# EasyEDA schematic Streamdeckv1_schematic.json
TITLE: Streamdeck PCB; REV: 1.0; Date: 2021-02-21; Sheet: 1/1; Drawn By: Sean Kelly; Company: Kelly Cafe

## Parts
B1  SPARKFUN_PRO_MICRO  [SPARKFUN_PRO_MICRO]
D1  DIODEDO-1N4148  [DO-1N4148]
D2  DIODEDO-1N4148  [DO-1N4148]
D3  DIODEDO-1N4148  [DO-1N4148]
D4  DIODEDO-1N4148  [DO-1N4148]
D5  DIODEDO-1N4148  [DO-1N4148]
D6  DIODEDO-1N4148  [DO-1N4148]
D7  DIODEDO-1N4148  [DO-1N4148]
D8  DIODEDO-1N4148  [DO-1N4148]
D9  DIODEDO-1N4148  [DO-1N4148]
D10  DIODEDO-1N4148  [DO-1N4148]
D11  DIODEDO-1N4148  [DO-1N4148]
D12  DIODEDO-1N4148  [DO-1N4148]
D13  DIODEDO-1N4148  [DO-1N4148]
D14  DIODEDO-1N4148  [DO-1N4148]
D15  DIODEDO-1N4148  [DO-1N4148]
D16  DIODEDO-1N4148  [DO-1N4148]
D17  LED3MM  [LED_3MM]
D18  LED3MM  [LED_3MM]
D19  LED3MM  [LED_3MM]
D20  DIODEDO-1N4148  [DO-1N4148]
R1  330  [AXIAL-0.3]
R2  330  [AXIAL-0.3]
R3  330  [AXIAL-0.3]
RE_0_1  CHERRY-MX-ENCODER  [CHERRY-MX-ENCODER]  (sections 1,2)
RE_0_4  CHERRY-MX-ENCODER  [CHERRY-MX-ENCODER]  (sections 1,2)
RE_3_0  CHERRY-MX-ENCODER  [CHERRY-MX-ENCODER]  (sections 1,2)
RE_3_1  CHERRY-MX-ENCODER  [CHERRY-MX-ENCODER]  (sections 1,2)
RE_3_4  CHERRY-MX-ENCODER  [CHERRY-MX-ENCODER]  (sections 1,2)
S2  MOMENTARY-SWITCH-SPST-LED-PTH-CHERRY  [CHERRY-MX-LED]
S3  MOMENTARY-SWITCH-SPST-LED-PTH-CHERRY  [CHERRY-MX-LED]
S5  MOMENTARY-SWITCH-SPST-LED-PTH-CHERRY  [CHERRY-MX-LED]
S6  MOMENTARY-SWITCH-SPST-LED-PTH-CHERRY  [CHERRY-MX-LED]
S7  MOMENTARY-SWITCH-SPST-LED-PTH-CHERRY  [CHERRY-MX-LED]
S8  MOMENTARY-SWITCH-SPST-LED-PTH-CHERRY  [CHERRY-MX-LED]
S9  MOMENTARY-SWITCH-SPST-LED-PTH-CHERRY  [CHERRY-MX-LED]
S10  MOMENTARY-SWITCH-SPST-LED-PTH-CHERRY  [CHERRY-MX-LED]
S11  MOMENTARY-SWITCH-SPST-LED-PTH-CHERRY  [CHERRY-MX-LED]
S12  MOMENTARY-SWITCH-SPST-LED-PTH-CHERRY  [CHERRY-MX-LED]
S14  MOMENTARY-SWITCH-SPST-LED-PTH-CHERRY  [CHERRY-MX-LED]
S15  MOMENTARY-SWITCH-SPST-LED-PTH-CHERRY  [CHERRY-MX-LED]
S17  MOMENTARY-SWITCH-SPST-PTH-6.0MM  [TACTILE_SWITCH_PTH_6.0MM]

## Nets
GND: B1.3(GND) B1.4(GND) B1.23(GND) D17.K(C) D18.K(C) D19.K(C) RE_0_1.C RE_0_4.C RE_3_0.C RE_3_1.C RE_3_4.C S17.1
VCC: B1.21(VCC)
COL0: B1.8(*5) RE_3_0.E(2) RE_3_0.S2(2)
COL1: B1.9(*6) RE_0_1.E(2) RE_0_1.S2(2) RE_3_1.E(2) RE_3_1.S2(2) S5.S2(2) S9.S2(2)
COL2: B1.10(7) S2.S2(2) S6.S2(2) S10.S2(2) S14.S2(2)
COL3: B1.11(8) S3.S2(2) S7.S2(2) S11.S2(2) S15.S2(2)
COL4: B1.12(*9) RE_0_4.E(2) RE_0_4.S2(2) RE_3_4.E(2) RE_3_4.S2(2) S8.S2(2) S12.S2(2)
ENCODER0_L0: B1.14(11(MOSI)) RE_0_1.B RE_3_0.B RE_3_1.B
ENCODER0_L1: B1.7(4) RE_0_1.A RE_3_0.A RE_3_1.A
ENCODER1_L0: B1.6(*3) RE_0_4.B RE_3_4.B
ENCODER1_L1: B1.5(2) RE_0_4.A RE_3_4.A
LED0: B1.13(*10) R3.P$2(2)
LED1: B1.16(13(SCK)) R2.P$2(2)
LED2: B1.15(12(MISO)) R1.P$2(2)
NC/RX/D2: B1.2(RXI)
NC/TX/D3: B1.1(TXO)
RAW: B1.24(RAW)
RESET: B1.22(RESET) S17.3(2)
ROW0: B1.20(A3) D1.C D2.C D3.C D4.C
ROW1: B1.19(A2) D5.C D6.C D7.C D8.C
ROW2: B1.18(A1) D9.C D10.C D11.C D12.C
ROW3: B1.17(A0) D13.C D14.C D15.C D16.C D20.C
Net-(D1-A): D1.A RE_0_1.D(1) RE_0_1.S1(1)
Net-(D2-A): D2.A S2.S1(1)
Net-(D3-A): D3.A S3.S1(1)
Net-(D4-A): D4.A RE_0_4.D(1) RE_0_4.S1(1)
Net-(D5-A): D5.A S5.S1(1)
Net-(D6-A): D6.A S6.S1(1)
Net-(D7-A): D7.A S7.S1(1)
Net-(D8-A): D8.A S8.S1(1)
Net-(D9-A): D9.A S9.S1(1)
Net-(D10-A): D10.A S10.S1(1)
Net-(D11-A): D11.A S11.S1(1)
Net-(D12-A): D12.A S12.S1(1)
Net-(D13-A): D13.A RE_3_1.D(1) RE_3_1.S1(1)
Net-(D14-A): D14.A S14.S1(1)
Net-(D15-A): D15.A S15.S1(1)
Net-(D16-A): D16.A RE_3_4.D(1) RE_3_4.S1(1)
Net-(D17-A): D17.A R1.P$1(1)
Net-(D18-A): D18.A R2.P$1(1)
Net-(D19-A): D19.A R3.P$1(1)
Net-(D20-A): D20.A RE_3_0.D(1) RE_3_0.S1(1)

Not connected (* = marked no-connect by the designer): S2 A K(C); S3 A K(C); S5 A K(C); S6 A K(C); S7 A K(C); S8 A K(C); S9 A K(C); S10 A K(C); S11 A K(C); S12 A K(C); S14 A K(C); S15 A K(C)
